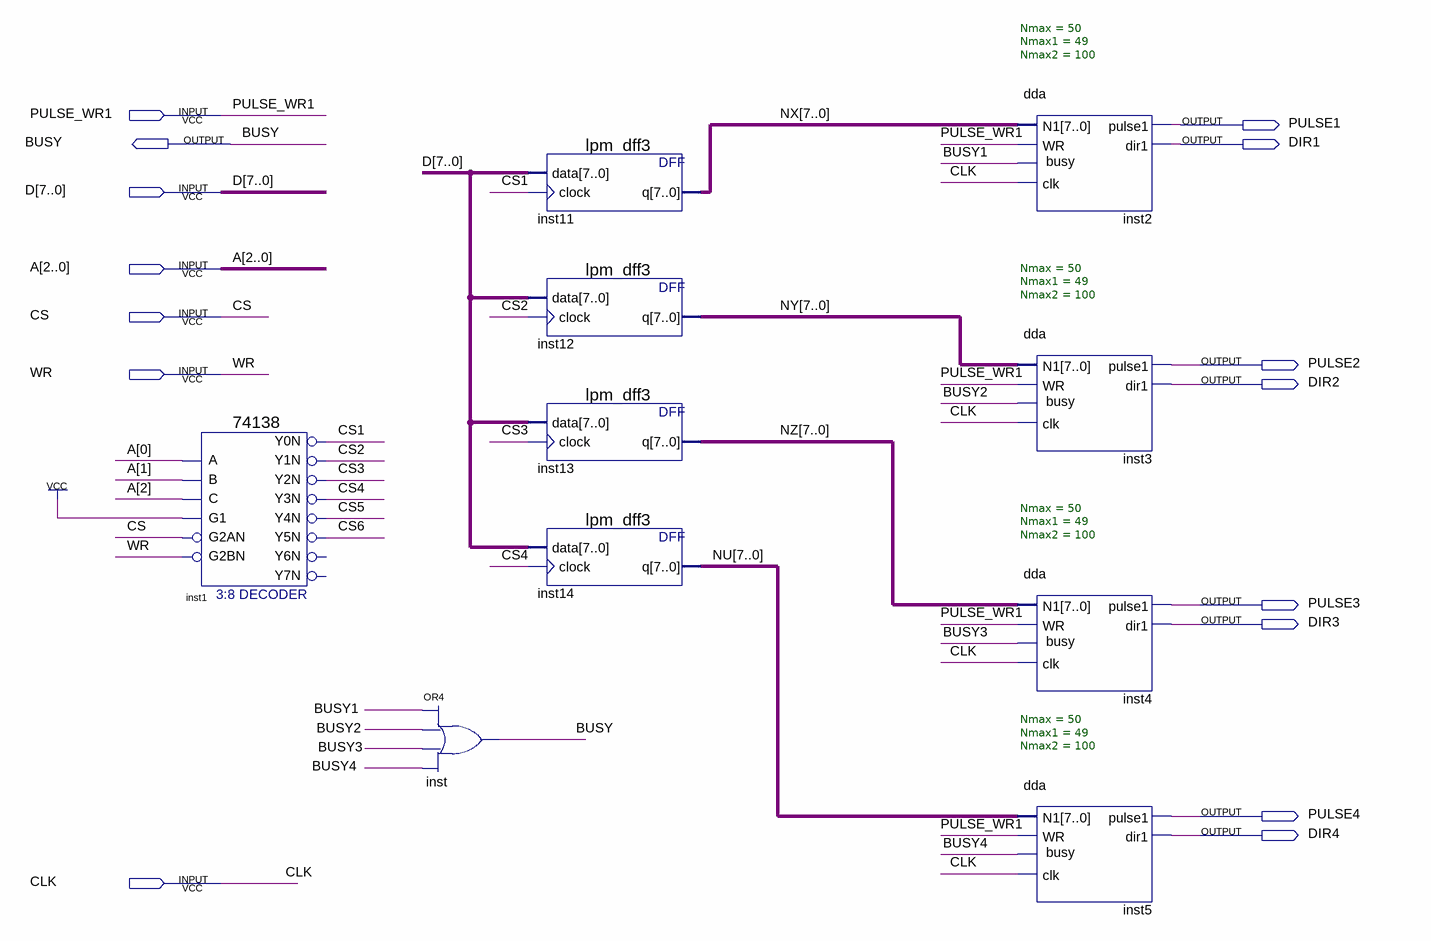
[diagram p0: schematic sheet]
// Quartus schematic dda_module.bdf as structural Verilog: 10 symbols, 15 pins
module dda_module (
  input  PULSE_WR1,
  input  [7:0] D,
  input  [2:0] A,
  input  CS,
  input  WR,
  input  CLK,
  output PULSE1,
  output BUSY,
  output DIR1,
  output PULSE2,
  output DIR2,
  output PULSE3,
  output DIR3,
  output PULSE4,
  output DIR4
);

  wire BUSY1, BUSY2, BUSY3, BUSY4, CS1, CS2, CS3, CS4, CS5, CS6;
  wire [7:0] NU, NX, NY, NZ;

  \74138  inst1 (
    .A(A[0]), .B(A[1]), .G1(1'b1), .C(A[2]), .G2AN(CS), .G2BN(WR), .Y0N(CS1), .Y1N(CS2), .Y2N(CS3),
    .Y3N(CS4), .Y4N(CS5), .Y5N(CS6));  // open: Y6N, Y7N
  or inst (BUSY, BUSY1, BUSY2, BUSY3, BUSY4);
  lpm_dff3 inst11 (.data(D), .clock(CS1), .q(NX));
  lpm_dff3 inst12 (.data(D), .clock(CS2), .q(NY));
  lpm_dff3 inst13 (.data(D), .clock(CS3), .q(NZ));
  lpm_dff3 inst14 (.data(D), .clock(CS4), .q(NU));
  dda #(.Nmax(50), .Nmax1(49), .Nmax2(100)) inst2 (
    .N1(NX), .WR(PULSE_WR1), .clk(CLK), .pulse1(PULSE1), .dir1(DIR1), .busy(BUSY1));
  dda #(.Nmax(50), .Nmax1(49), .Nmax2(100)) inst3 (
    .N1(NY), .WR(PULSE_WR1), .clk(CLK), .pulse1(PULSE2), .dir1(DIR2), .busy(BUSY2));
  dda #(.Nmax(50), .Nmax1(49), .Nmax2(100)) inst4 (
    .N1(NZ), .WR(PULSE_WR1), .clk(CLK), .pulse1(PULSE3), .dir1(DIR3), .busy(BUSY3));
  dda #(.Nmax(50), .Nmax1(49), .Nmax2(100)) inst5 (
    .N1(NU), .WR(PULSE_WR1), .clk(CLK), .pulse1(PULSE4), .dir1(DIR4), .busy(BUSY4));
endmodule
